# Altium schematic sheet SDCard.SchDoc
size A4; SheetNumber: 6; SheetTotal: 8
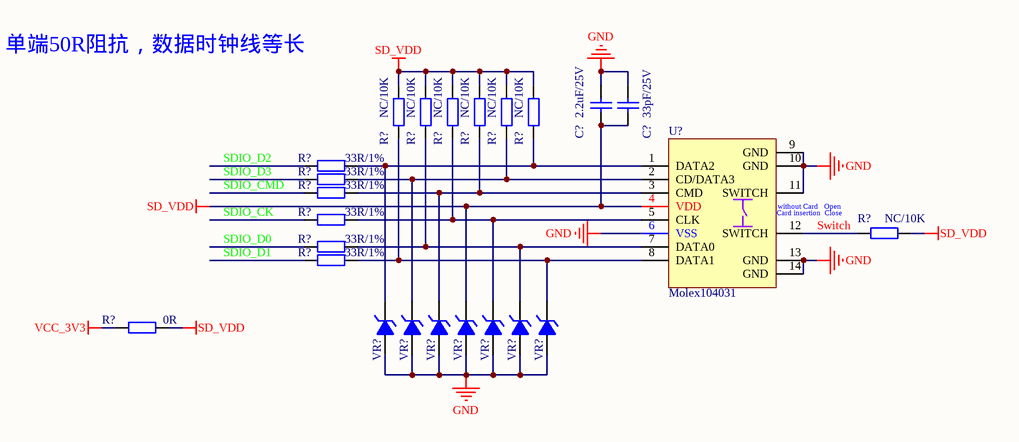
[diagram p0: SDCard.SchDoc]

## Parts
(Parts that share a designator on the sheet are numbered #1, #2 ... from top to bottom, then left to right.)
C?#1  2.2uF/25V  [C0402_L]
C?#2  33pF/25V  [C0402_L]
R?#1  NC/10K  [R0402_L]
R?#2  NC/10K  [R0402_L]
R?#3  NC/10K  [R0402_L]
R?#4  NC/10K  [R0402_L]
R?#5  NC/10K  [R0402_L]
R?#6  NC/10K  [R0402_L]
R?#7  33R/1%  [R0402_L]
R?#8  33R/1%  [R0402_L]
R?#9  33R/1%  [R0402_L]
R?#10  33R/1%  [R0402_L]
R?#11  NC/10K  [R0402_L]
R?#12  33R/1%  [R0402_L]
R?#13  33R/1%  [R0402_L]
R?#14  0R  [R0402_L]
U?  Molex104031  [插拔式MicroSD卡]
VR?#1  ESD9D5U  [SOD-923]  (value not drawn)
VR?#2  ESD9D5U  [SOD-923]  (value not drawn)
VR?#3  ESD9D5U  [SOD-923]  (value not drawn)
VR?#4  ESD9D5U  [SOD-923]  (value not drawn)
VR?#5  ESD9D5U  [SOD-923]  (value not drawn)
VR?#6  ESD9D5U  [SOD-923]  (value not drawn)
VR?#7  ESD9D5U  [SOD-923]  (value not drawn)

## Nets
GND: C?#1.2 C?#2.2 U?.6(VSS) U?.9(GND) U?.10(GND) U?.11(SWITCH) U?.13(GND) U?.14(GND) VR?#1.2(A) VR?#2.2(A) VR?#3.2(A) VR?#4.2(A) VR?#5.2(A) VR?#6.2(A) VR?#7.2(A)
SD_VDD: C?#1.1 C?#2.1 R?#1.2 R?#2.2 R?#3.2 R?#4.2 R?#5.2 R?#6.2 R?#11.1 R?#14.2 U?.4(VDD) VR?#4.1(K)
VCC_3V3: R?#14.1
SDIO_CK: R?#10.1
SDIO_CMD: R?#9.1
SDIO_D0: R?#12.1
SDIO_D1: R?#13.1
SDIO_D2: R?#7.1
SDIO_D3: R?#8.1
Switch: R?#11.2 U?.12(SWITCH)
NetR?#1_1: R?#1.1 R?#13.2 U?.8(DATA1) VR?#7.1(K)
NetR?#2_1: R?#2.1 R?#12.2 U?.7(DATA0) VR?#6.1(K)
NetR?#3_1: R?#3.1 R?#10.2 U?.5(CLK) VR?#5.1(K)
NetR?#4_1: R?#4.1 R?#9.2 U?.3(CMD) VR?#3.1(K)
NetR?#5_1: R?#5.1 R?#8.2 U?.2(CD/DATA3) VR?#2.1(K)
NetR?#6_1: R?#6.1 R?#7.2 U?.1(DATA2) VR?#1.1(K)

## Notes on the sheet
- 单端50R阻抗，数据时钟线等长
- (near U?) without Card   Open
- (near U?) Card insertion  Close

## Library data of the parts
C?#1 C?#2 = C: 贴片电容; BOM名称: 无极性贴片电容; 联系卖家，免费查找封装: 唯一出售店铺网址https://shop463601444.taobao.com
R?#1-R?#14 = R: 贴片电阻; 联系卖家，免费查找封装: 唯一出售店铺网址https://shop463601444.taobao.com; BOM名称: 贴片电阻
U? = Molex104031: 拔插式超薄TF卡座
VR?#1-VR?#7 = Diode4: 瞬态电压抑制二极管